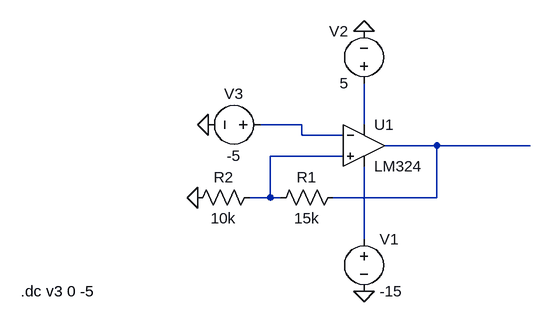
[diagram p0: schematic Draft1.asc]
Draft1.asc, the LTspice schematic file:
Version 4
SHEET 1 880 680
WIRE 320 288 256 288
WIRE 416 288 416 224
WIRE 320 304 320 288
WIRE 384 304 320 304
WIRE 528 320 448 320
WIRE 672 320 528 320
WIRE 384 336 272 336
WIRE 272 400 272 336
WIRE 272 400 240 400
WIRE 288 400 272 400
WIRE 528 400 528 320
WIRE 528 400 368 400
WIRE 416 464 416 352
FLAG 416 144 0
FLAG 176 288 0
FLAG 416 544 0
FLAG 160 400 0
SYMBOL voltage 416 448 R0
SYMATTR InstName V1
SYMATTR Value -15
SYMBOL voltage 272 288 R90
WINDOW 0 -32 56 VBottom 2
WINDOW 3 32 56 VTop 2
SYMATTR InstName V3
SYMATTR Value -5
SYMBOL res 384 384 R90
WINDOW 0 0 56 VBottom 2
WINDOW 3 32 56 VTop 2
SYMATTR InstName R1
SYMATTR Value 15k
SYMBOL res 256 384 R90
WINDOW 0 0 56 VBottom 2
WINDOW 3 32 56 VTop 2
SYMATTR InstName R2
SYMATTR Value 10k
SYMBOL Opamps/LM324 416 320 R0
SYMATTR InstName U1
SYMBOL voltage 416 240 R180
WINDOW 0 24 96 Left 2
WINDOW 3 24 16 Left 2
SYMATTR InstName V2
SYMATTR Value 5
TEXT -112 544 Left 2 !.dc v3 0 -5

The netlist it stands for:
* Draft1.asc
V1 N005 0 -15
V3 N001 0 -5
R1 N003 N004 15k
R2 N004 0 10k
* U1: LM324 (symbol Opamps/LM324 not available, pins judged from their places): In+=N004 In-=N001 V+=N002 V-=N005 OUT=N003
V2 N002 0 5
.dc v3 0 -5
.backanno
.end